# Altium schematic sheet Circuit overview.SchDoc
size A4; SheetNumber: 2; SheetTotal: 2
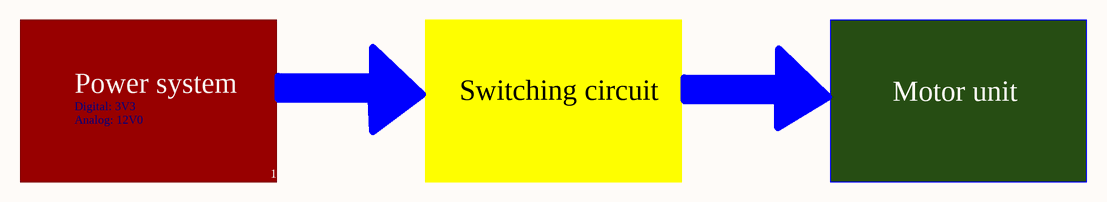
[diagram p0: Circuit overview.SchDoc]

## Notes on the sheet
- Power system
- Switching circuit
- Digital: 3V3
- Analog: 12V0
- Motor unit
- 1